# EAGLE design RTCModule (EAGLE 5.10)
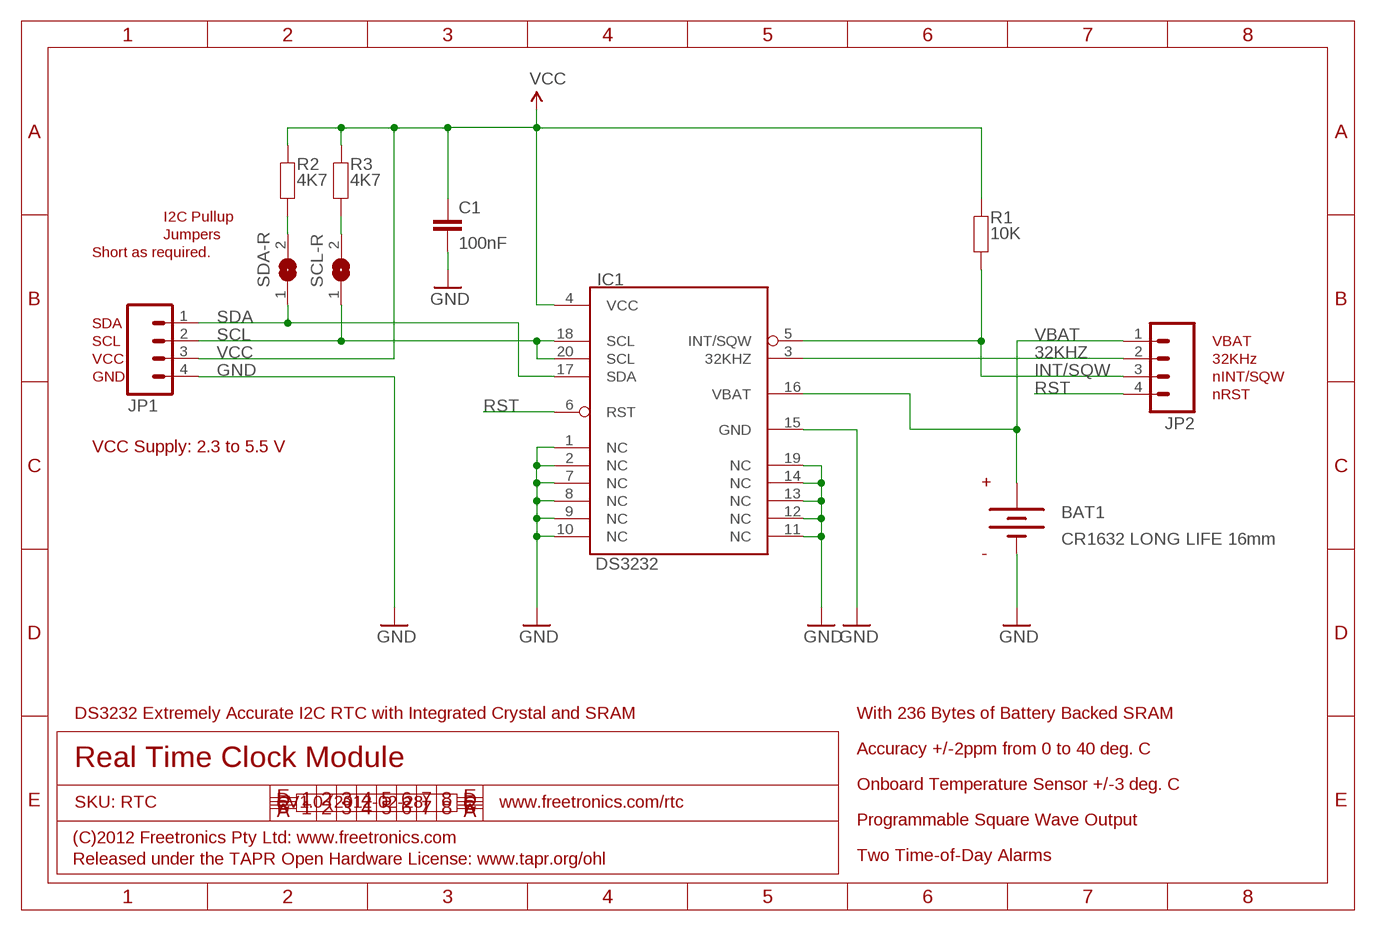
[diagram p0: schematic, sheet 1]

## Parts
BAT1  CR1632 LONG LIFE 16mm  BATTERY  [BATCON_16MM]
C1  100nF  CAP0603  [0603]
IC1  DS3232  [SO20L]
JP1  M04PTH  [1X04]
JP2  M04PTH  [1X04]
R1  10K  RESISTOR0603  [0603]
R2  4K7  RESISTOR0603  [0603]
R3  4K7  RESISTOR0603  [0603]
SCL-R  SJSTD  [SJ]
SDA-R  SJSTD  [SJ]

## Nets
32KHZ: IC1.3(32KHZ) JP2.2
GND: BAT1.GND(-) C1.2 IC1.1(NC) IC1.2(NC) IC1.7(NC) IC1.8(NC) IC1.9(NC) IC1.10(NC) IC1.11(NC) IC1.12(NC) IC1.13(NC) IC1.14(NC) IC1.15(GND) IC1.19(NC) JP1.4
INT/SQW: IC1.5(INT/SQW) JP2.3 R1.1
N$2: R2.1 SDA-R.2
N$3: R3.1 SCL-R.2
RST: IC1.6(RST) JP2.4
SCL: IC1.18(SCL) IC1.20(SCL) JP1.2 SCL-R.1
SDA: IC1.17(SDA) JP1.1 SDA-R.1
VBAT: BAT1.PWR@1(+) IC1.16(VBAT) JP2.1
VCC: C1.1 IC1.4(VCC) JP1.3 R1.2 R2.2 R3.2

## Notes on the sheet
- I2C Pullup
- Jumpers
- Short as required.
- SDA
- SCL | VBAT
- VCC | 32KHz
- GND | nINT/SQW
- nRST
- VCC Supply: 2.3 to 5.5 V
- +
- -
- DS3232 Extremely Accurate I2C RTC with Integrated Crystal and SRAM | With 236 Bytes of Battery Backed SRAM
- Accuracy +/-2ppm from 0 to 40 deg. C
- Real Time Clock Module
- Onboard Temperature Sensor +/-3 deg. C
- SKU: RTC | V1.0 (2012-02-28) | www.freetronics.com/rtc
- Programmable Square Wave Output
- (C)2012 Freetronics Pty Ltd: www.freetronics.com
- Released under the TAPR Open Hardware License: www.tapr.org/ohl | Two Time-of-Day Alarms

## Library data of the parts
BAT1 = freetronics-master-v1:BATTERY: Battery Holders Various common sizes : AA, AAA, 20mm coin cell and 12mm coin cell.
C1 = freetronics-master-v1:CAP: Capacitor Standard 0603 ceramic capacitor, and 0.1" leaded capacitor.
IC1 = freetronics-master-v1:DS3232: DS3232 Extremely Accurate I2C RTC with Integrated Crystal and SRAM
JP1 JP2 = freetronics-master-v1:M04: Header 4 Standard 4-pin 0.1" header. Use with straight break away headers (SKU : PRT-00116), right angle break away headers (PRT-00553), swiss pins (PRT-00743), machine pins (PRT-00117), and female headers (PRT-00115). Molex polarized connector foot print use with SKU : PRT-08231 with associated crimp pins and housings.
R1-R3 = freetronics-master-v1:RESISTOR: Resistor Basic schematic elements and footprints for 0603, 1206, and PTH 1/10th watt (small) resistors.
SCL-R SDA-R = freetronics-master-v1:SJ: SMD solder JUMPER

## Board
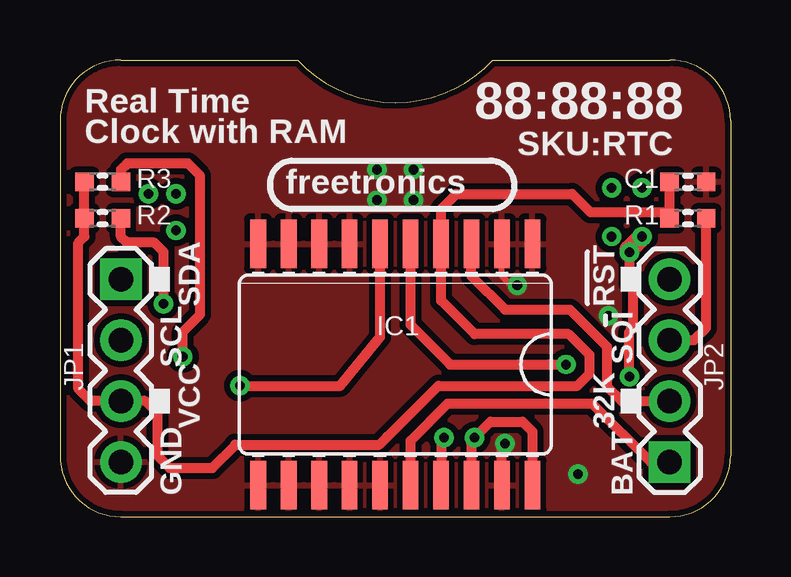
[diagram p1: board, top side]
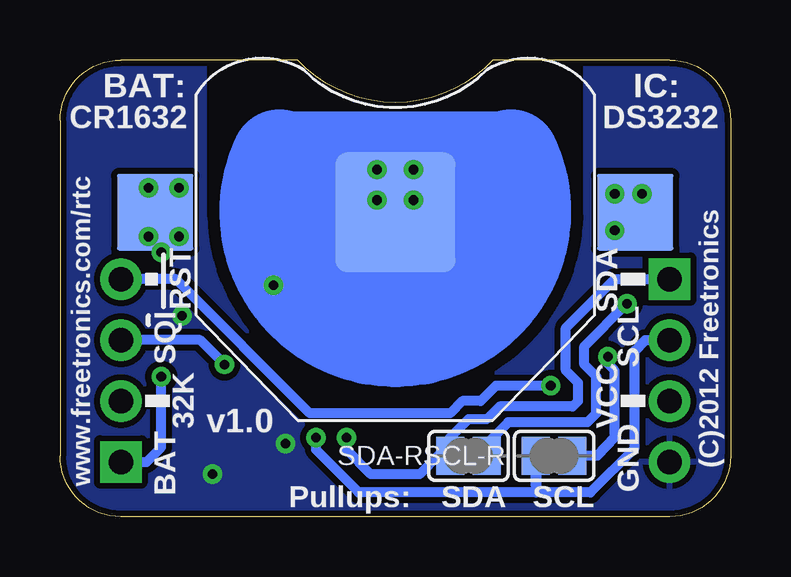
[diagram p2: board, bottom side, seen from below]

Size 27.94 x 19.05 mm. Coordinates in mm from the lower left corner, seen from the top.
Outline: 0,2.54 arc90 2.54,0 25.4,0 arc90 27.94,2.54 27.94,16.51 arc90 25.4,19.05 18.03,19.05 arc-47 13.97,17.27 arc-47 9.91,19.05 2.54,19.05 arc90 0,16.51 0,2.54
Copper layers (1*16): Top 0.035mm / dielectric 1.5mm / Bottom 0.035mm
Design rules "default *": minimum track width 8mil, minimum drill 15mil, track to track 10mil, track to pad 10mil, pad to pad 10mil, via to via 10mil, smd to smd 8mil, copper to edge 10mil, drill to drill 8mil, minimum pad ring 14mil, minimum via ring 8mil, stop-mask expansion 4mil, vias tented up to drill 25mil, thermal gap 10mil
bRestrict: area 6.2,12.5 to 21.8,19.1; 1 lines

### Footprints (pad centres in the part's own frame; a part is rotated, then mirrored left to right if it is on the bottom)
BATCON_16MM = smd 5 x 5: GND 0,0 | smd 3.175 x 3.175: PWR@1 -10,0; PWR@2 10,0
0603 = smd 0.762 x 0.762: 1 -0.762,0; 2 0.762,0
SO20L = smd 0.66 x 2.032: 1 -5.715,-5.029; 2 -4.445,-5.029; 3 -3.175,-5.029; 4 -1.905,-5.029; 5 -0.635,-5.029; 6 0.635,-5.029; 7 1.905,-5.029; 8 3.175,-5.029; 9 4.445,-5.029; 10 5.715,-5.029; 11 5.715,5.029; 12 4.445,5.029; 13 3.175,5.029; 14 1.905,5.029; 15 0.635,5.029; 16 -0.635,5.029; 17 -1.905,5.029; 18 -3.175,5.029; 19 -4.445,5.029; 20 -5.715,5.029
1X04 = drill 1.016 square: 1 0,0 | drill 1.016 round: 2 2.54,0; 3 5.08,0; 4 7.62,0
SJ = smd 1.168 x 1.6: 1 -0.762,0; 2 0.762,0

### Placement (x,y rotation side)
BAT1  13.97,12.7 0 bottom
C1  26.16,13.97 0 top
IC1  13.97,6.35 180 top
JP1  2.54,9.91 270 top
JP2  25.4,2.29 90 top
R1  26.16,12.45 180 top
R2  1.78,12.45 180 top
R3  1.78,13.97 180 top
SCL-R  7.35,2.54 0 bottom
SDA-R  10.92,2.54 0 bottom

### Tracks (layer width: path | path; a pad name or v marks a point on that pad's centre or on a via)
32KHZ
  Top 0.406: JP2.2 23.4,4.83 22.78,5.44 22.78,7.1 21.24,8.64 18.54,8.64 17.14,10.03 IC1.3
GND  (via drill 0.4)
  Top 0.254: IC1.2 18.41,10.03 18.8,9.65 v19.05,9.65
  Top 0.406: IC1.19 18.41,3.05 v18.54,3.05
  Bottom 0.254: v14.73,13.21 14.48,13.21 BAT1.GND | v19.05,9.65 19.05,11.18 17.02,13.21
  Bottom 0.406: 9.14,14.99 10.92,13.21 v13.21,13.21 | 18.8,14.99 17.02,13.21 v14.73,13.21
  Bottom 4: 9.14,14.99 arc230 18.8,14.99
  other vias: 21.59,1.78 13.21,14.48 14.73,14.48 22.86,8.38
  pour Top: 2.54,19.05 arc90 0,16.51 0,2.54 arc90 2.54,0 25.4,0 arc90 27.94,2.54 27.94,16.51 arc90 25.4,19.05 18.03,19.05 16.76,18.03 15.75,17.53 arc-31 14.48,17.27 arc8 13.46,17.27 arc-31 12.19,17.53 10.67,18.29 9.91,19.05
  pour Bottom: 2.54,19.05 arc90 0,16.51 0,2.54 arc90 2.54,0 25.4,0 arc90 27.94,2.54 27.94,16.51 arc90 25.4,19.05 18.03,19.05 16.76,18.03 15.75,17.53 arc-31 14.48,17.27 arc8 13.46,17.27 arc-31 12.19,17.53 10.67,18.29 9.91,19.05
INT/SQW  (via drill 0.4)
  Top 0.406: R1.1 26.92,7.87 26.42,7.37 JP2.3 | IC1.5 14.61,8 16.26,6.35 v21.08,6.35
  Bottom 0.406: v21.08,6.35 22.1,7.37 JP2.3
N$1  (via drill 0.4)
  other vias: 3.68,13.46
N$2  (via drill 0.4)
  Top 0.406: v4.32,8.89 4.32,11.05 3.94,11.43 2.79,11.43 2.54,11.68 R2.1
  Bottom 0.406: SDA-R.2 10.16,3.05 9.27,3.94 5.97,3.94 5.59,4.32 5.59,5.84 6.1,6.35 6.1,7.11 v4.32,8.89
N$3  (via drill 0.4)
  Top 0.406: v5.12,6.67 5.12,7.71 5.84,8.44 5.84,14.22 5.33,14.73 2.79,14.73 2.54,14.48 R3.1
  Bottom 0.406: v5.12,6.67 5.12,6.38 4.83,6.1 4.83,3.3 5.55,2.55 5.56,2.54 SCL-R.2
N$4  (via drill 0.4)
  other vias: 4.83,13.46
N$5  (via drill 0.4)
  other vias: 4.83,11.94
RST  (via drill 0.4)
  Top 0.406: IC1.6 13.34,7.49 11.68,5.46 v7.49,5.46
  Bottom 0.406: v7.49,5.46 9.78,5.46 10.41,4.83 11.18,4.83 11.68,4.32 17.53,4.32 23.11,9.91 JP2.4
SCL  (via drill 0.4)
  Top 0.406: v17.27,3.3 17.14,3.05 | v17.27,3.3 17.93,3.96 19.28,3.96 19.68,3.56 IC1.20 | 17.14,3.05 17.14,3.43 v17.27,3.3 | 17.14,3.05 IC1.18
  Bottom 0.406: v17.27,3.3 17.27,2.79 15.49,1.02 8.11,1.02 | 8.1,1.07 SCL-R.1 8.11,1.52 8.11,1.02 | 8.11,1.02 5.84,1.02 4,2.86 4,6.92 3.56,7.37 JP1.2
SDA  (via drill 0.4)
  Top 0.406: IC1.17 15.88,3.17 v16,3.3
  Bottom 0.406: v16,3.3 16,2.79 14.99,1.78 12.95,1.78 12.19,2.54 SDA-R.1 11.68,3.3 10.92,4.06 10.16,4.06 9.63,4.6 6.58,4.6 6.35,4.83 6.35,5.59 6.86,6.1 6.86,7.87 4.83,9.91 JP1.1
VBAT  (via drill 0.4)
  Top 0.406: IC1.16 14.61,3.17 16.16,4.73 22.17,4.73 24.61,2.29 JP2.1 | v23.72,5.84 23.72,7.72 23.88,7.87 23.88,9.53 23.75,9.65 23.75,10.92 v23.72,11.02
  Top 0.813: v23.72,11.02 23.72,11.15 v24.26,11.68
  Bottom 0.254: v22.99,13.72 v24.26,13.72 24.26,12.99 BAT1.PWR@1 | v22.99,11.68 23.37,11.68 23.62,11.94
  Bottom 0.406: v23.72,5.84 23.72,2.89 24.33,2.29 JP2.1
  Bottom 0.813: BAT1.PWR@1 23.62,12.19 23.62,11.94 v23.72,11.02
VCC
  Top 0.406: 25.4,12.7 22.1,12.7 21.34,13.46 16.51,13.46 15.88,12.83 IC1.4 15.88,9.02 17.27,7.62 21.2,7.62 22.07,6.75 22.07,5.97 21.56,5.46 15.77,5.46 15.41,5.1 13.63,3.33 13.3,3 7.3,3 7.3,2.98 6.35,2.03 4.57,2.03 4.06,2.54 4.06,4.32 3.56,4.83 JP1.3 1.27,4.83 0.76,5.33 0.76,11.43 1.02,11.68 R2.2 R3.2 | 25.4,12.7 R1.2 | 25.4,12.7 C1.1
(copper drawn outside any net)
  shapes: Bottom area x1

### Text on the board
tPlace: Real Time | 88:88:88 | Clock with RAM | SKU:RTC | freetronics | SDA | RST | SCL | SQI | VCC | 32K | GND | BAT
bPlace: IC: | BAT: | DS3232 | CR1632 | SDA | RST | SCL | SQI | VCC | v1.0 | 32K | (C)2012 Freetronics | GND | BAT | www.freetronics.com/rtc | SCL | SDA | Pullups: